# EAGLE design ConsSens (EAGLE 6.6.0)
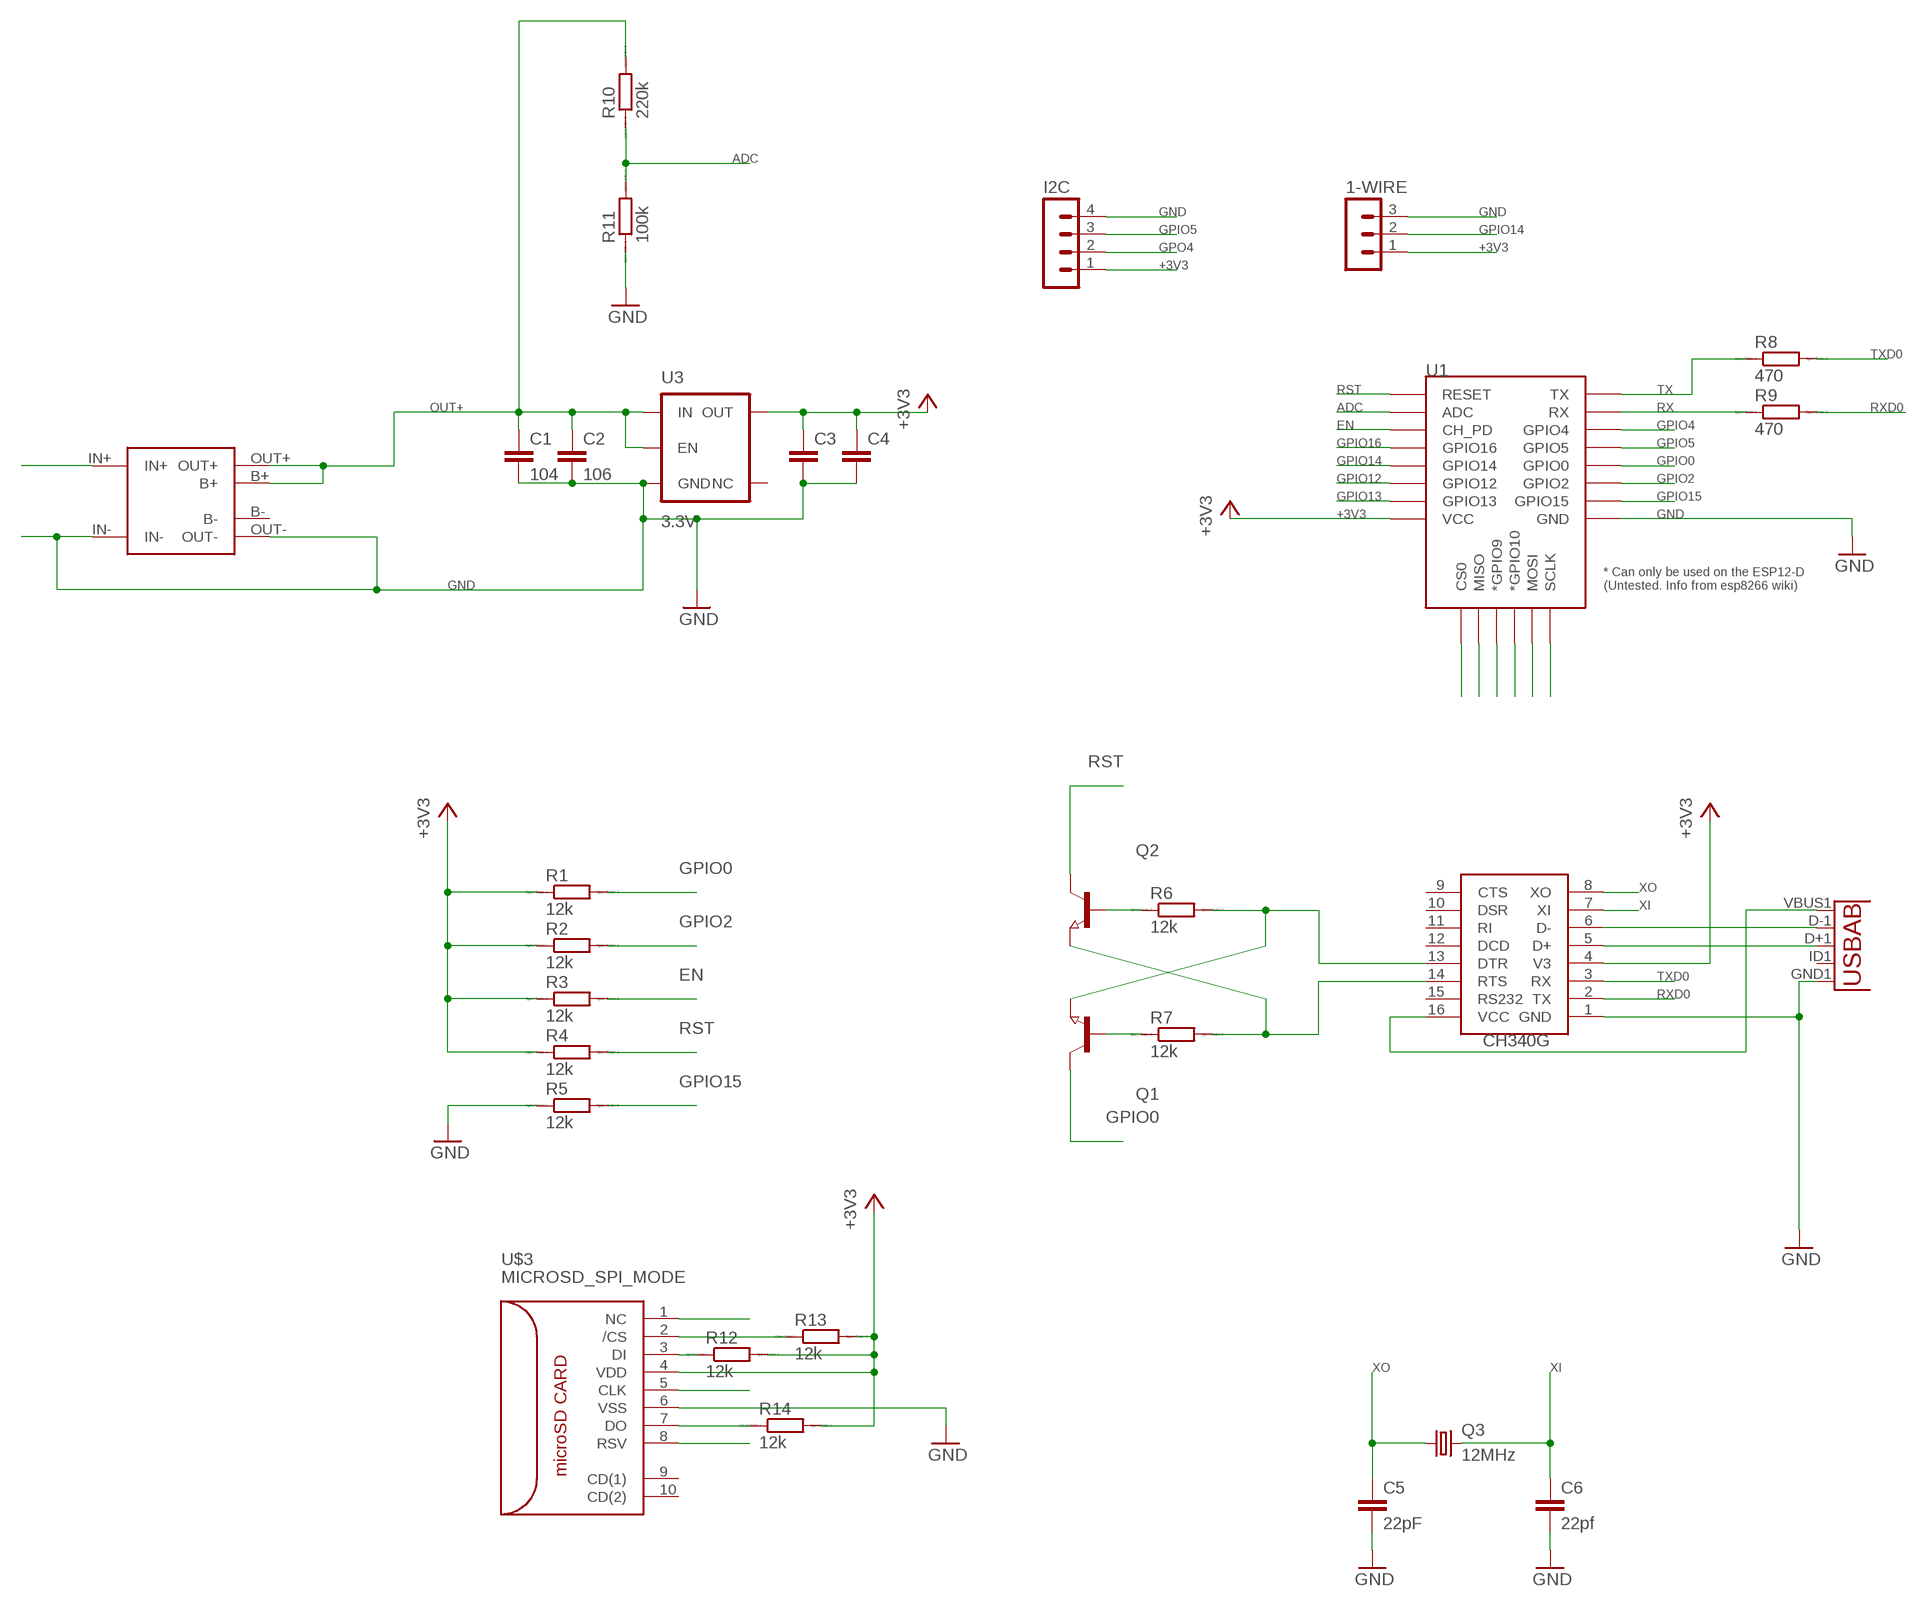
[diagram p0: schematic, sheet 1]

## Parts
1-WIRE  MA03-1  [MA03-1]
C1  104  C-EUC0805  [C0805]
C2  106  C-EUC0805  [C0805]
C3  C-EUC0805  [C0805]
C4  C-EUC0805  [C0805]
C5  22pF  C-EUC0805  [C0805]
C6  22pf  C-EUC0805  [C0805]
I2C  MA04-1  [MA04-1]
MICROUSB  USB""  [USB-MICRO-SMD]
Q1  NPN-TRANSISTOR_SOT23  [SOT23]
Q2  NPN-TRANSISTOR_SOT23  [SOT23]
Q3  12MHz  CRYSTALCRYSTAL-SMD-5X3-12MHZ  [CRYSTAL-SMD-5X3]
R1  12k  RR0603  [R0603]
R2  12k  RR0603  [R0603]
R3  12k  RR0603  [R0603]
R4  12k  RR0603  [R0603]
R5  12k  RR0603  [R0603]
R6  12k  RR0603  [R0603]
R7  12k  RR0603  [R0603]
R8  470  RR0603  [R0603]
R9  470  RR0603  [R0603]
R10  220k  RR0603  [R0603]
R11  100k  RR0603  [R0603]
R12  12k  RR0603  [R0603]
R13  12k  RR0603  [R0603]
R14  12k  RR0603  [R0603]
U1  ESP12ESMD  [ESP12E-SMD]
U3  3.3V  V_REG_AP2112K-3.3V  [SOT23-5]
U$1  CH340G  [SOIC16]
U$3  MICROSD_SPI_MODE  [MICRO_SD_CONNECTOR]
U$4  TP4056-MODULE  [TP4056-LITHIUM-PROTECTED-MODULE]

## Nets
+3V3: 1-WIRE.1 C3.1 C4.1 I2C.1 R1.1 R2.1 R3.1 R4.1 U1.VCC U3.5(OUT) U$1.4(V3)
ADC: R10.1 R11.2 U1.ADC
EN: R3.2 U1.CH_PD
GND: 1-WIRE.3 C1.2 C2.2 C3.2 C4.2 C5.2 C6.2 I2C.4 MICROUSB.GND1(GND) R5.1 R11.1 R12.2 R13.2 R14.2 U1.GND U3.2(GND) U$1.1(GND) U$3.4(VDD) U$3.6(VSS) U$4.IN- U$4.OUT- ; supply symbol labelled +3V3
GPIO0: Q1.3(C) R1.2 U1.GPIO0
GPIO2: R2.2 U1.GPIO2
GPIO4: U1.GPIO4
GPIO5: I2C.3 U1.GPIO5
GPIO12: R14.1 U1.GPIO12 U$3.7(DO)
GPIO13: R12.1 U1.GPIO13 U$3.3(DI)
GPIO14: 1-WIRE.2 U1.GPIO14 U$3.5(CLK)
GPIO15: R5.2 R13.1 U1.GPIO15 U$3.2(/CS)
GPIO16: U1.GPIO16
GPO4: I2C.2
N$1: Q1.1(B) R7.1
N$2: Q2.1(B) R6.1
N$3: Q2.2(E) R7.2 U$1.14(RTS)
N$4: Q1.2(E) R6.2 U$1.13(DTR)
N$5: MICROUSB.D-1(D-) U$1.6(D-)
N$6: MICROUSB.D+1(D+) U$1.5(D+)
N$8: U$3.1(NC)
N$9: U1.CS0
N$10: U1.MISO
N$11: U1.GPIO9(*GPIO9)
N$12: U1.GPIO10(*GPIO10)
N$13: U1.MOSI
N$14: U1.SCLK
N$20: U$3.8(RSV)
OUT+: C1.1 C2.1 R10.2 U3.1(IN) U3.3(EN) U$4.B+ U$4.OUT+
RST: Q2.3(C) R4.2 U1.RESET
RX: R9.1 U1.RXD0(RX)
RXD0: R9.2 U$1.2(TX)
TX: R8.1 U1.TXD0(TX)
TXD0: R8.2 U$1.3(RX)
USB5V: MICROUSB.VBUS1(VBUS) U$1.16(VCC) U$4.IN+
XI: C6.1 Q3.3 U$1.7(XI)
XO: C5.1 Q3.1 U$1.8(XO)
Unconnected: MICROUSB.ID1(USBID) U3.4(NC) U$1.9(CTS) U$1.10(DSR) U$1.11(RI) U$1.12(DCD) U$1.15(RS232) U$3.9(CD(1)) U$3.10(CD(2))

## Power pins joined to a net without a drawn wire
B-: U$4.B-

## Library data of the parts
1-WIRE = con-lstb:MA03-1: PIN HEADER; OC_FARNELL: unknown; OC_NEWARK: unknown
C1-C6 = resistor:C-EU: CAPACITOR, European symbol
I2C = con-lstb:MA04-1: PIN HEADER; OC_FARNELL: unknown; OC_NEWARK: unknown
MICROUSB = MicroUSB:USB: This is a USB AB connector that is compatible with USB OTG. i.e. this connector can serve as a host or device
Q1 Q2 = semicon-smd-ipc:NPN-TRANSISTOR_: NPN TRANSISTOR
Q3 = SparkFun-FreqCtrl:CRYSTAL: Various standard crystals. Proven footprints.; PROD_ID: XTAL-08297
R1-R14 = eagle-ltspice:R: RESISTOR, European symbol; SPICEMODEL: NONE; SPICEPREFIX: R
U1 = esp8266modules:ESP12E: ESP12E Module
U3 = SparkFun-PowerIC:V_REG_AP2112: AP2112 - 600mA CMOS LDO Regulator w/ Enable The AP2112 is CMOS process low dropout linear regulator with enable function, the regulator delivers a guaranteed 600mA (min.) continuous load current. Features Output Voltage Accuracy: ±1.5% Output Current: 600mA (Min.) Foldback Short Current Protection: 50mA Enable Function to Turn ON/OFF VOUT Low Dropout Voltage (3.3V): 250mV (Typ.) @IOUT=600mA Excellent Load Regulation: 0.2%/A (Typ.) Excellent Line Regulation: 0.02%/V (Typ.) Low Quiescent Current: 55μA (Typ.) Low Standby Current: 0.01μA (Typ.) Low Output Noise: 50μVRMS PSRR: 100Hz -65dB, 1kHz -65dB OTSD Protection Stable with 1.0μF Flexible Cap: Ceramic, Tantalum and Aluminum Electrolytic Operation Temperature Range: -40°C to 85°C ESD: MM 400V, HBM 4000V; PROD_ID: VREG-12457
U$1 = ch340g:CH340G
U$3 = con-molex-microsd:MICROSD_SPI_MODE: MOLEX - 49225-0821 - CONNECTEUR MICRO SD PUSH/PUSH REV Fabricant: MOLEX Code commande Farnell: 1366700 <http://fr.farnell.com/molex/49225-0821/connecteur-micro-sd-push-push-rev/dp/1366700?Ntt=1366700> Référence fabricant: 49225-0821
U$4 = userlib:TP4056-MODULE

## Board
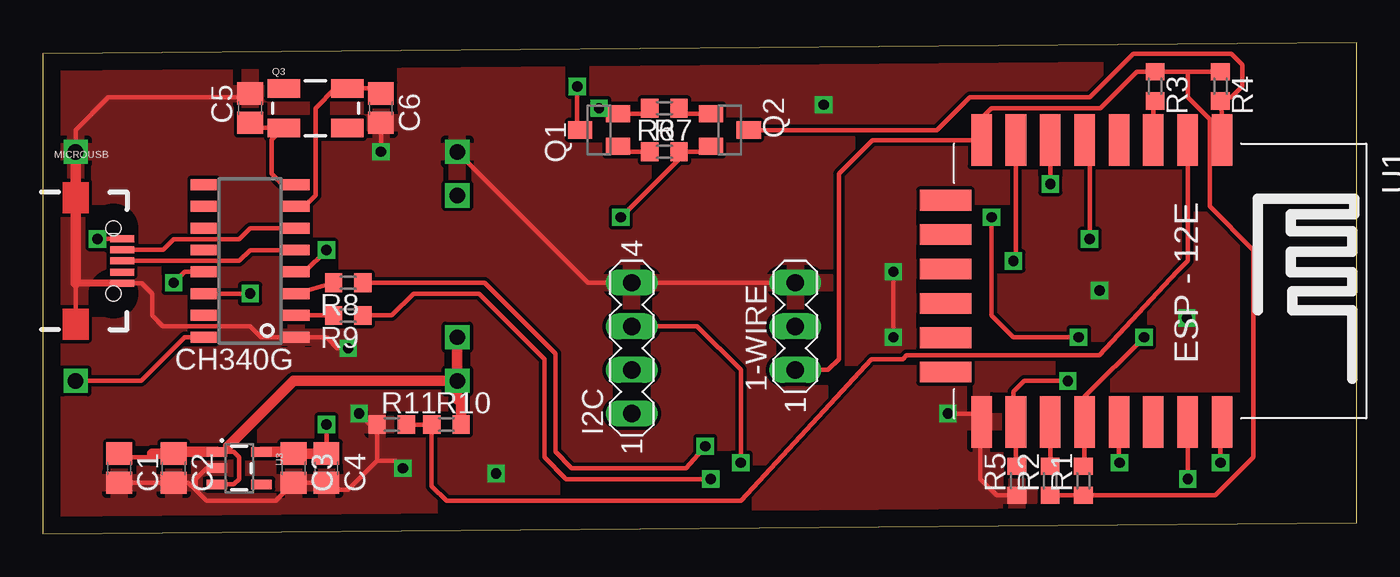
[diagram p1: board, top side]
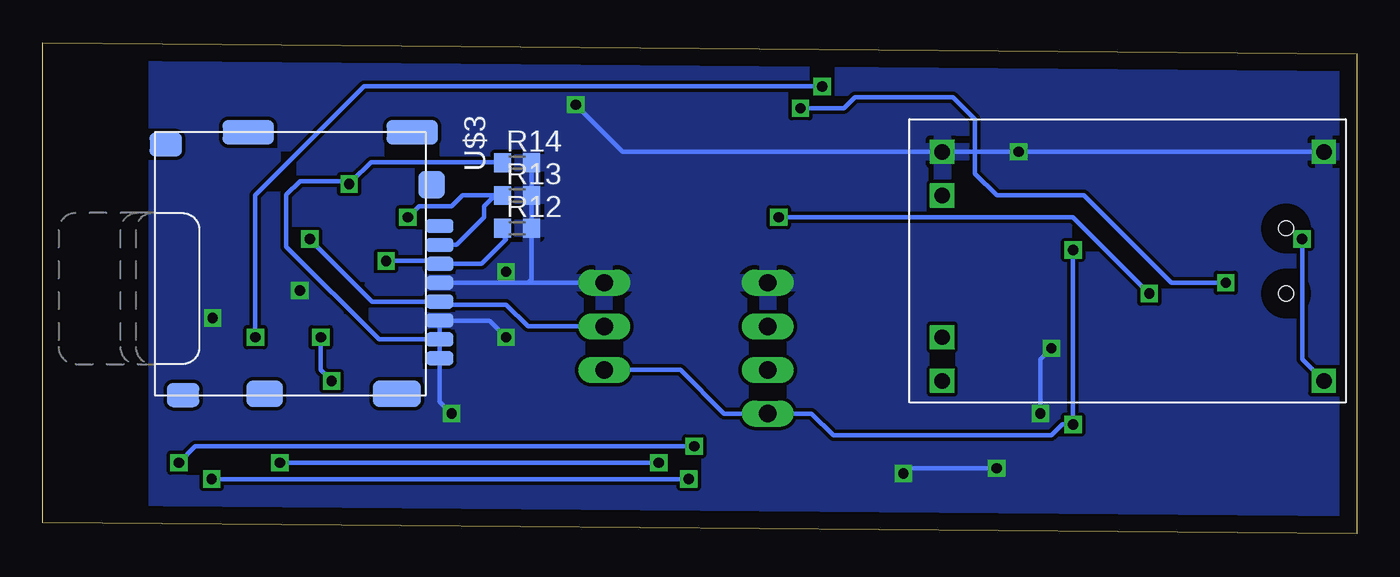
[diagram p2: board, bottom side, seen from below]

Size 76.5 x 28.57 mm. Coordinates in mm from the lower left corner, seen from the top.
Outline: 0,0 76.5,0.64 76.5,28.57 0,27.93 0,0
Copper layers (1*16): Top 0.035mm / dielectric 1.5mm / Bottom 0.035mm
Design rules "default": minimum track width 10mil, minimum drill 24mil, track to track 8mil, track to pad 8mil, pad to pad 8mil, via to via 8mil, smd to smd 8mil, copper to edge 40mil, drill to drill 8mil, minimum pad ring 10mil, minimum via ring 8mil, stop-mask expansion 4mil, vias tented up to drill 0mil, thermal gap 10mil

### Footprints (pad centres in the part's own frame; a part is rotated, then mirrored left to right if it is on the bottom)
MA03-1 = drill 1.016 long: 1 -2.54,0; 2 0,0; 3 2.54,0
C0805 = smd 1.3 x 1.5: 1 -0.85,0; 2 0.85,0
MA04-1 = drill 1.016 long: 1 -3.81,0; 2 -1.27,0; 3 1.27,0; 4 3.81,0
USB-MICRO-SMD = smd 1.4 x 0.4: D+1 2.7,0; D-1 2.7,0.65; GND1 2.7,-1.3; ID1 2.7,-0.65; VBUS1 2.7,1.3 | hole 0.85: 2.2,1.9; 2.2,-1.9
SOT23 = smd 1 x 1.4: 1 -0.95,-1.1; 2 0.95,-1.1; 3 0,1.1
CRYSTAL-SMD-5X3 = smd 1.9 x 1.1: 1 -1.85,-1.15; 2 1.85,-1.15; 3 1.85,1.15; 4 -1.85,1.15
R0603 = smd 1 x 1.1: 1 -0.85,0; 2 0.85,0
ESP12E-SMD = smd 3 x 1.2: ADC -8.3,3.8; CH_PD -8.3,1.8; GND 8.1,-8.2; GPIO0 8.1,-2.2; GPIO2 8.1,-4.2; GPIO4 8.1,1.8; GPIO5 8.1,-0.2; GPIO12 -8.3,-4.2; GPIO13 -8.3,-6.2; GPIO14 -8.3,-2.2; GPIO15 8.1,-6.2; GPIO16 -8.3,-0.2; RESET -8.3,5.8; RXD0 8.1,3.8; TXD0 8.1,5.8; VCC -8.3,-8.2 | smd 1.2 x 3: CS0 -4.8,-10.3; GPIO9 -0.8,-10.3; GPIO10 1.2,-10.3; MISO -2.8,-10.3; MOSI 3.2,-10.3; SCLK 5.2,-10.3
SOT23-5 = smd 0.55 x 1.2: 1 -0.95,-1.3; 2 0,-1.3; 3 0.95,-1.3; 4 0.95,1.3; 5 -0.95,1.3
SOIC16 = smd 0.635 x 1.524: 1 -4.445,-2.695; 2 -3.175,-2.695; 3 -1.905,-2.695; 4 -0.635,-2.695; 5 0.635,-2.695; 6 1.905,-2.695; 7 3.175,-2.695; 8 4.445,-2.695; 9 4.445,2.695; 10 3.175,2.695; 11 1.905,2.695; 12 0.635,2.695; 13 -0.635,2.695; 14 -1.905,2.695; 15 -3.175,2.695; 16 -4.445,2.695
MICRO_SD_CONNECTOR = smd 0.8 x 1.6: 1 -2.03,8.2; 2 -0.93,8.2; 3 0.17,8.2; 4 1.27,8.2; 5 2.37,8.2; 6 3.47,8.2; 7 4.57,8.2; 8 5.67,8.2 | smd 1.55 x 2.8: 9 7.735,5.7 | smd 1.55 x 2.1: 10 7.735,-2 | smd 1.4 x 1.9: 11 7.81,-6.75; 12 -6.79,-7.75 | smd 1.4 x 3: 13 -7.49,-2.95; 14 -7.49,6.6 | smd 1.6 x 1.55: 15 -4.43,7.725
TP4056-LITHIUM-PROTECTED-MODULE = drill 0.9 square: B+ 10.795,4.445; B- 10.795,-3.81; IN+ -11.43,6.985; IN- -11.43,-6.35; OUT+ 10.795,6.985; OUT- 10.795,-6.35

### Placement (x,y rotation side)
1-WIRE  43.82,12.06 90 top
C1  4.45,3.81 270 top
C2  7.62,3.81 270 top
C3  14.61,3.81 270 top
C4  16.51,3.81 270 top
C5  12.06,24.77 90 top
C6  19.68,24.77 270 top
I2C  34.29,10.79 90 top
MICROUSB  1.91,15.88 0 top
Q1  32.39,23.5 90 top
Q2  40.01,23.5 270 top
Q3  15.88,24.77 0 top
R1  60.59,3.08 90 top
R2  58.66,3.08 90 top
R3  64.77,26.04 270 top
R4  68.58,26.04 270 top
R5  56.72,3.08 90 top
R6  36.2,24.77 180 top
R7  36.2,22.23 0 top
R8  17.78,14.61 180 top
R9  17.78,12.7 180 top
R10  23.49,6.35 0 top
R11  20.32,6.35 0 top
R12  48.9,17.78 0 bottom
R13  48.9,19.69 0 bottom
R14  48.9,21.59 0 bottom
U1  62.87,14.61 270 top
U3  11.43,3.81 270 top
U$1  12.06,15.88 90 top
U$3  61.59,15.88 270 bottom
U$4  13.34,15.88 180 bottom

### Tracks (layer width: path | path; a pad name or v marks a point on that pad's centre or on a via)
+3V3  (via drill 0.6)
  Top 0.254: R4.1 66.67,26.89 | 66.67,26.89 R3.1 63.71,26.89 61.91,25.08 61.59,24.77 55.25,24.77 54.61,24.13 54.61,22.96 U1.VCC 48.3,22.91 46.36,20.96 46.36,10.16 45.72,9.53 1-WIRE.1 | R1.1 R2.1 68.27,2.23 70.48,4.45 70.48,16.51 67.94,19.05 67.94,24.13 66.67,25.4 66.67,26.89 | v16.51,6.35 C4.1 | U$1.4 15.24,15.24 v16.51,16.51
  Top 0.61: U3.5 14.61,4.76 C3.1 C4.1
  Bottom 0.254: 1-WIRE.1 39.37,9.53 36.83,6.98 I2C.1 31.75,6.98 30.48,5.71 17.78,5.71 17.13,6.37 16.56,6.37 16.56,6.35 v16.51,6.35 v16.51,16.51
ADC
  Top 0.254: R11.2 R10.1 22.64,2.75 23.49,1.91 40.64,1.91 48.26,10.16 50.07,10.16 50.29,10.37 61.14,10.37 61.53,10.39 66.04,15.24 66.66,15.88 U1.ADC
EN
  Top 0.254: U1.CH_PD 64.66,25.08 R3.2
GND  (via drill 0.6)
  Top 0.254: U3.2 9.53,3.81 8.89,3.17 8.89,2.54 | 8.89,2.54 9.53,1.91 13.55,1.91 C3.2 C4.2 16.51,2.54 17.78,2.54 19.47,4.23 | 19.47,4.23 R11.1 19.05,6.35 v18.41,6.99 | 44.45,14.61 1-WIRE.3 I2C.4 31.75,14.61 U$4.OUT- | R5.1 55.56,2.23 54.61,3.17 54.61,6.45 U1.GND 54.19,6.98 v52.71,6.98 | v49.53,11.43 v49.53,15.24 | C1.2 C2.2 8.47,2.96 8.89,2.54 | 19.47,4.23 20.54,4.23 v20.95,3.81 | v17.78,10.79 17.14,10.79 16.51,11.43 U$1.1 12.7,11.43 12.06,12.06 6.99,12.06 6.35,12.7 6.35,13.97 5.75,14.57 MICROUSB.GND1 | U$4.IN- 1.91,23.5 3.81,25.4 11.85,25.4 C5.2 | 1.91,12.06 1.91,14.61 1.93,14.57 | C6.2 v19.68,22.23
  Top 0.406: MICROUSB.GND1 1.93,14.57
  Top 0.61: U$4.IN- 1.91,14.61
  Bottom 0.254: U$3.4 49.53,14.61 | 49.53,14.61 48.26,14.61 | 48.26,14.61 1-WIRE.3 | v52.71,6.98 53.4,7.67 U$3.6 50.51,12.4 v49.53,11.43 | v49.53,15.24 49.53,14.61 | 48.26,14.61 48.05,14.82 R12.2 R13.2 R14.2 | v18.41,6.99 18.41,10.16 v17.78,10.79 | v20.95,3.81 26.08,3.81 v26.39,3.5 | v45.48,24.96 42.74,22.23 U$4.OUT- v19.68,22.23 U$4.IN-
  other vias: 61.53,14.15 66.62,12.56
  pour Top: -0.64,28.58 69.21,28.58 69.21,0.64 -0.64,0.64
  pour Bottom: -0.64,28.58 69.85,28.58 69.85,0.64 -0.64,0.64
GPIO0  (via drill 0.6)
  Top 0.254: R1.2 60.66,4 U1.GPIO0 60.66,7.96 v64.13,11.43 | v31.11,26.04 31.11,23.67 Q1.3
  Bottom 0.254: v64.13,11.43 64.13,19.69 57.79,26.04 v31.11,26.04
GPIO2
  Top 0.254: U1.GPIO2 R2.2
GPIO5  (via drill 0.6)
  Top 0.254: U1.GPIO5 62.66,4.01 v62.71,4.13 | v40.64,4.13 40.64,9.53 38.1,12.06 I2C.3
  Bottom 0.254: v40.64,4.13 62.23,4.13 v62.71,4.13
GPIO12  (via drill 0.6)
  Top 0.254: U1.GPIO12 58.66,20.19 v58.67,20.35
  Bottom 0.254: R14.1 49.78,21.62 57.4,21.62 58.51,20.51 | U$3.7 56.94,11.3 62.33,16.69 62.33,19.71 61.53,20.51 58.51,20.51 | v58.67,20.35 58.51,20.51
GPIO13  (via drill 0.6)
  Top 0.254: U1.GPIO13 56.66,16.03 v56.52,15.88
  Bottom 0.254: v56.52,15.88 53.57,15.88 U$3.3 50.97,15.71 49.53,17.15 49.75,17.36 R12.1
GPIO14  (via drill 0.6)
  Top 0.254: v60.96,17.15 60.96,22.61 U1.GPIO14
  Bottom 0.254: 1-WIRE.2 48.26,12.06 49.53,13.33 53.23,13.33 U$3.5 57.32,13.5 v60.96,17.15
GPIO15  (via drill 0.6)
  Top 0.254: R5.2 56.66,3.97 U1.GPIO15 56.52,6.65 56.52,8.26 57.15,8.89 v59.69,8.89 | v55.25,18.42 55.25,12.7 56.52,11.43 v60.33,11.43
  Bottom 0.254: U$3.2 52.41,16.81 50.8,18.42 50.8,19.05 50.16,19.69 R13.1 52.07,19.69 52.71,19.05 54.61,19.05 v55.25,18.42 | v60.33,11.43 60.33,9.53 v59.69,8.89
N$1
  Top 0.254: R7.1 33.8,22.23 Q1.1
N$2
  Top 0.254: Q2.1 37.37,24.45 R6.1
N$3  (via drill 0.6)
  Top 0.254: Q2.2 38.59,22.23 R7.2 37.05,21.81 v33.66,18.42 | v12.06,13.97 U$1.14
  Bottom 0.254: v33.66,18.42 16.51,18.42 v12.06,13.97
N$4  (via drill 0.6)
  Top 0.254: R6.2 35.02,24.45 Q1.2 33.16,24.77 v32.39,24.77 | U$1.13 8.26,15.24 v7.62,14.61
  Bottom 0.254: v7.62,14.61 10.79,14.61 15.88,19.69 20.95,19.69 22.22,20.96 22.22,24.13 23.49,25.4 29.21,25.4 29.84,24.77 v32.39,24.77
N$5
  Top 0.254: U$1.6 12.06,17.78 11.43,17.15 7.62,17.15 7,16.53 MICROUSB.D-1
N$6
  Top 0.254: U$1.5 12.06,16.51 11.43,15.88 MICROUSB.D+1
OUT+
  Top 0.254: U3.1 10.79,4.76 | 10.79,4.76 11.12,4.76 11.43,4.45 11.43,3.17 11.12,2.86 U3.3 | 6.35,4.45 4.66,4.45 C1.1 | 10.79,4.76 10.79,5.08 | 24.13,7.83 24.34,7.62
  Top 0.61: U3.1 8.26,4.76 C2.1 6.35,4.66 6.35,4.45 | R10.2 24.34,7.62 24.34,7.83 | 10.79,5.08 14.61,8.89 U$4.OUT+ | U$4.OUT+ U$4.B+ | U$4.OUT+ 24.13,7.83
RST
  Top 0.254: U1.RESET 68.66,24.46 R4.2 68.8,25.4 69.21,25.4 69.85,26.04 69.85,27.31 69.21,27.94 63.5,27.94 60.96,25.4 53.98,25.4 52.07,23.5 Q2.3
RX  (via drill 0.6)
  Top 0.254: v38.89,3.17 30.48,3.17 29.21,4.45 29.21,10.16 25.4,13.97 21.59,13.97 20.32,12.7 R9.1 | v66.67,3.17 U1.RXD0
  Bottom 0.254: v38.89,3.17 v66.67,3.17
RXD0
  Top 0.254: R9.2 U$1.2
TX  (via drill 0.6)
  Top 0.254: R8.1 25.72,14.61 29.84,10.48 29.84,4.76 30.8,3.81 37.46,3.81 v38.58,5.08 | v68.58,4.13 68.58,4.45 68.58,6.42 U1.TXD0
  Bottom 0.254: v38.58,5.08 67.63,5.08 v68.58,4.13
TXD0
  Top 0.254: U$1.3 R8.2
USB5V  (via drill 0.6)
  Top 0.254: U$1.16 8.26,11.43 5.71,8.89 U$4.IN+ | MICROUSB.VBUS1 3.21,17.18 v3.17,17.15
  Bottom 0.254: v3.17,17.15 3.17,10.16 U$4.IN+
XI
  Top 0.254: C6.1 19.68,25.92 Q3.3 17.02,25.92 15.88,24.77 15.88,19.69 15.24,19.05 U$1.7
XO
  Top 0.254: C5.1 12.06,23.62 Q3.1 13.34,22.93 13.34,20.96 13.97,20.32 U$1.8